# EAGLE design solar_hv4-JR-01 (EAGLE 5.11)
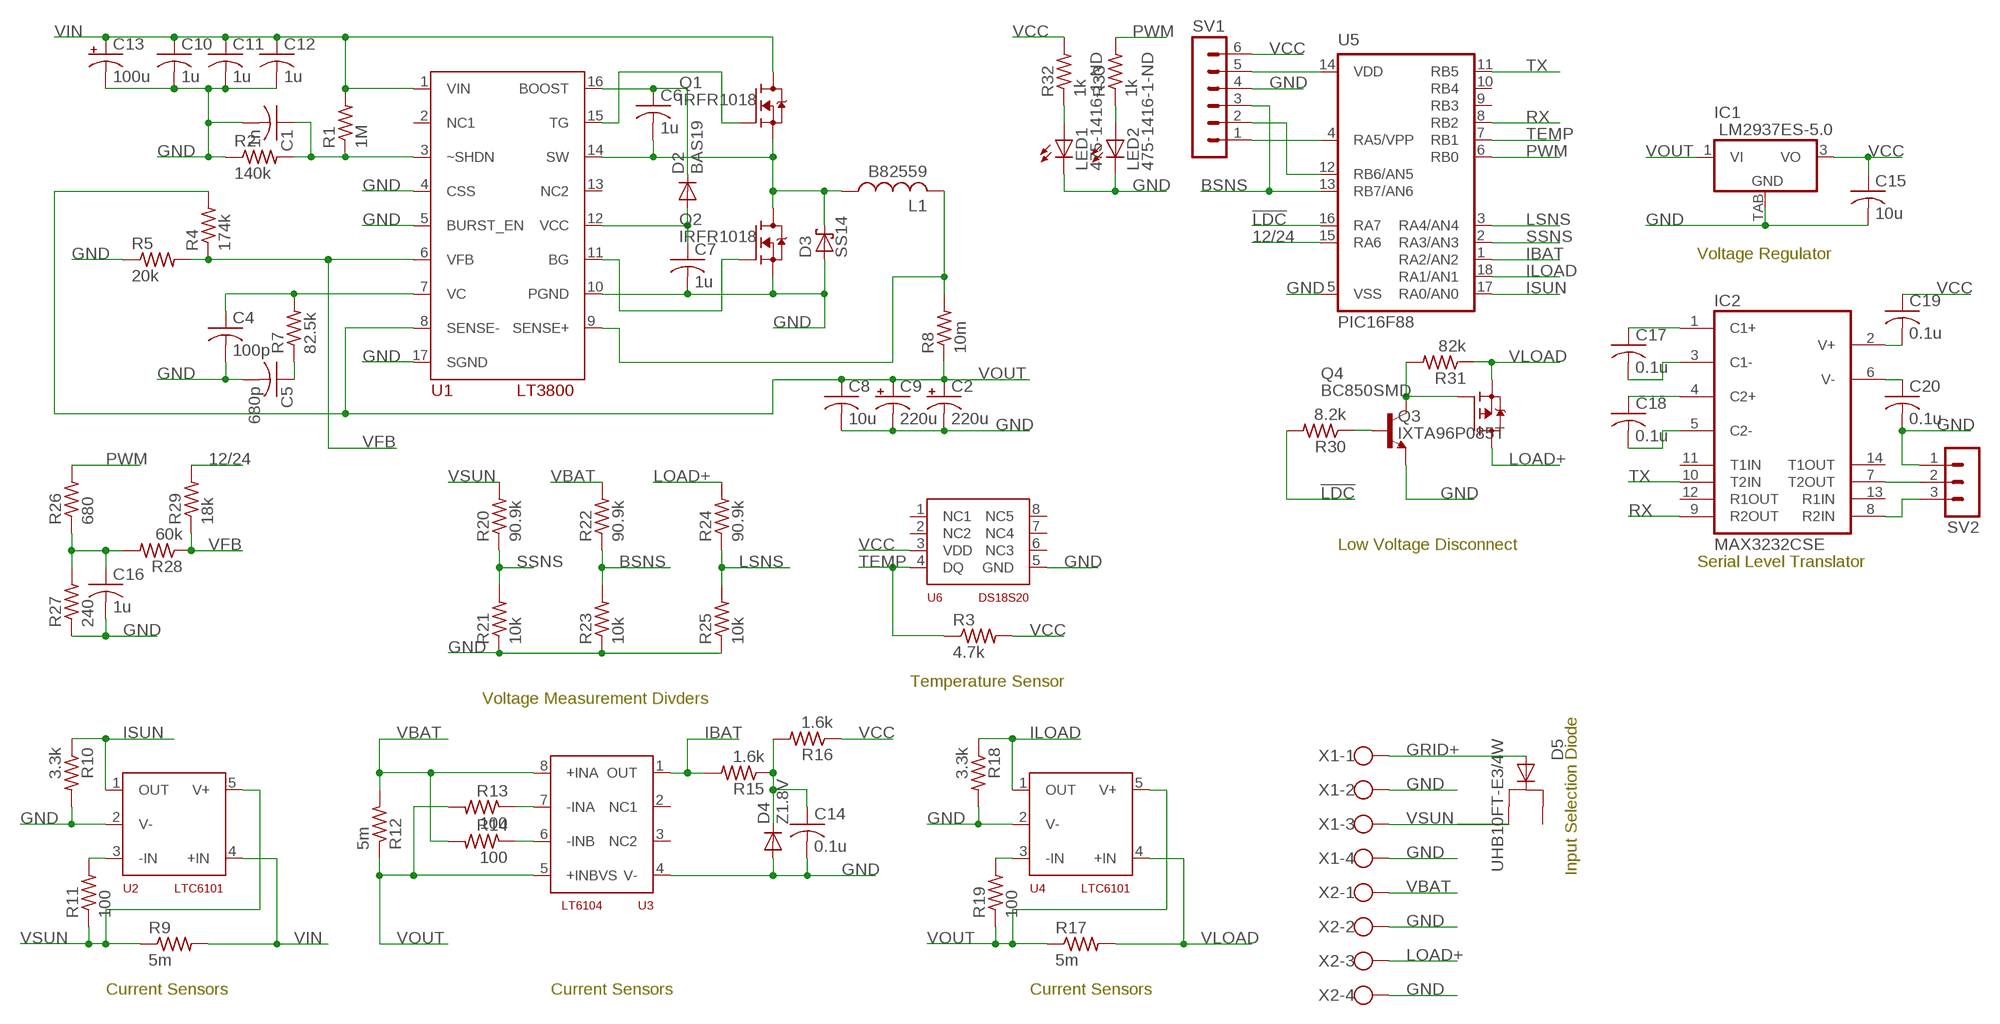
[diagram p0: schematic, sheet 1]

## Parts
C1  1n  C-USC1206  [C1206]
C2  220u  CPOL-USUD-10X10  [UD-10X10_NICHICON]
C4  100p  C-USC1206  [C1206]
C5  680p  C-USC1206  [C1206]
C6  1u  C-USC1206  [C1206]
C7  1u  C-USC1206  [C1206]
C8  10u  C-USC1210  [C1210]
C9  220u  CPOL-USUD-10X10  [UD-10X10_NICHICON]
C10  1u  C-USC1206  [C1206]
C11  1u  C-USC1206  [C1206]
C12  1u  C-USC1206  [C1206]
C13  100u  CPOL-USG  [PANASONIC_G]
C14  0.1u  C-USC1206  [C1206]
C15  10u  C-USC1210  [C1210]
C16  1u  C-USC1206  [C1206]
C17  0.1u  C-USC1206  [C1206]
C18  0.1u  C-USC1206  [C1206]
C19  0.1u  C-USC1206  [C1206]
C20  0.1u  C-USC1206  [C1206]
D2  BAS19  [SOT23]
D3  SS14  [SMA]
D4  Z1.8V  DIODE-SOD123  [SOD123]
D5  UHB10FT-E3/4W  BY229B  [TO263AB]
IC1  LM2937ES-5.0  LM340S-05  [TO263-3]
IC2  MAX3232CSE  [SO16]
L1  B82559  [L23X25MM]
LED1  475-1416-1-ND  LEDCHIPLED_1206  [CHIPLED_1206]
LED2  475-1416-1-ND  LEDCHIPLED_1206  [CHIPLED_1206]
Q1  IRFR1018  [TO252]
Q2  IRFR1018  [TO252]
Q3  IXTA96P085T  SPB80P06P  [TO263]
Q4  BC850SMD  [SOT23-BEC]
R1  1M  R-US_R1206  [R1206]
R2  140k  R-US_R1206  [R1206]
R3  4.7k  R-US_R1206  [R1206]
R4  174k  R-US_R1206  [R1206]
R5  20k  R-US_R1206  [R1206]
R7  82.5k  R-US_R1206  [R1206]
R8  10m  FCSLXXRXXXFCSL90R010  [FCSL90-10M]
R9  5m  FCSLXXRXXXFCSL64R005  [FCSL64-5M]
R10  3.3k  R-US_R1206  [R1206]
R11  100  R-US_R1206  [R1206]
R12  5m  FCSLXXRXXXFCSL64R005  [FCSL64-5M]
R13  100  R-US_R1206  [R1206]
R14  100  R-US_R1206  [R1206]
R15  1.6k  R-US_R1206  [R1206]
R16  1.6k  R-US_R1206  [R1206]
R17  5m  FCSLXXRXXXFCSL64R005  [FCSL64-5M]
R18  3.3k  R-US_R1206  [R1206]
R19  100  R-US_R1206  [R1206]
R20  90.9k  R-US_R1206  [R1206]
R21  10k  R-US_R1206  [R1206]
R22  90.9k  R-US_R1206  [R1206]
R23  10k  R-US_R1206  [R1206]
R24  90.9k  R-US_R1206  [R1206]
R25  10k  R-US_R1206  [R1206]
R26  680  R-US_R1206  [R1206]
R27  240  R-US_R1206  [R1206]
R28  60k  R-US_R1206  [R1206]
R29  18k  R-US_R1206  [R1206]
R30  8.2k  R-US_R1206  [R1206]
R31  82k  R-US_R1206  [R1206]
R32  1k  R-US_R1206  [R1206]
R33  1k  R-US_R1206  [R1206]
SV1  MA06-1  [MA06-1]
SV2  MA03-1  [MA03-1]
U1  LT3800  [TSSOP16]
U2  LTC6101  LT6101  [TSOT-23-5]
U3  LT6104  LTC1604  [MSOP8]
U4  LTC6101  LT6101  [TSOT-23-5]
U5  PIC16F88  PIC16F87/88  [DIL18]
U6  DS18S20  DS18S20Z  [SOIC8]
X1  W237-4  [W237-4]
X2  W237-4  [W237-4]

## Nets
12/24: R29.2 U5.15(RA6)
!LDC: R30.2 U5.16(RA7)
BG: Q2.1(G) U1.11(BG)
BSNS: R22.1 R23.2 SV1.3 U5.13(RB7/AN6)
GND: C1.2 C2.- C4.2 C5.2 C7.2 C8.2 C9.- C10.2 C11.2 C12.2 C13.- C14.2 C15.2 C16.2 C20.2 D3.A D4.A IC1.TAB(GND) LED1.C LED2.C Q2.2(S) Q4.E R2.1 R5.1 R10.2 R18.2 R21.1 R23.1 R25.1 R27.1 SV1.4 SV2.1 U1.4(CSS) U1.5(BURST_EN) U1.10(PGND) U1.17(SGND) U2.2(V-) U3.4(V-) U4.2(V-) U5.5(VSS) U6.5(GND) X1.2 X1.4 X2.2 X2.4
GRID+: D5.2 X1.1
IBAT: R15.2 U3.1(OUT) U5.1(RA2/AN2)
ILOAD: R18.1 U4.1(OUT) U5.18(RA1/AN1)
ISUN: R10.1 U2.1(OUT) U5.17(RA0/AN0)
LOAD+: Q3.3(D) R24.2 X2.3
LSNS: R24.1 R25.2 U5.3(RA4/AN4)
N$1: L1.P$2 R8.P$2 U1.9(SENSE+)
N$2: C1.1 R1.1 R2.2 U1.3(~SHDN)
N$5: R11.2 U2.3(-IN)
N$6: C16.1 R26.1 R27.2 R28.2
N$7: C6.1 D2.3(C) U1.16(BOOST)
N$9: C4.1 R7.2 U1.7(VC)
N$10: C5.1 R7.1
N$11: C6.2 D3.K(C) L1.P$1 Q1.2(S) Q2.3(D) U1.14(SW)
N$13: C7.1 D2.1(A) U1.12(VCC)
N$14: R14.1 U3.6(-INB)
N$15: R19.2 U4.3(-IN)
N$17: R13.1 U3.7(-INA)
N$18: C14.1 D4.C R15.1 R16.2
N$19: SV1.1 U5.4(RA5/VPP)
N$21: SV1.5 U5.14(VDD)
N$22: C17.1 IC2.1(C1+)
N$23: C17.2 IC2.3(C1-)
N$24: SV1.2 U5.12(RB6/AN5)
N$25: C18.1 IC2.4(C2+)
N$26: C18.2 IC2.5(C2-)
N$27: C19.2 IC2.2(V+)
N$28: C20.1 IC2.6(V-)
N$29: IC2.7(T2OUT) SV2.2
N$30: IC2.8(R2IN) SV2.3
N$31: LED1.A R32.1
N$32: Q3.1(G) Q4.C R31.2
N$33: Q4.B R30.1
N$34: LED2.A R33.1
PWM: R26.2 R33.2 U5.6(RB0)
RX: IC2.9(R2OUT) U5.8(RB2)
SSNS: R20.1 R21.2 U5.2(RA3/AN3)
TEMP: R3.1 U5.7(RB1) U6.4(DQ)
TG: Q1.1(G) U1.15(TG)
TX: IC2.10(T2IN) U5.11(RB5)
VBAT: R12.P$2 R14.2 R22.2 U3.8(+INA) X2.1
VCC: C15.1 C19.1 IC1.3(VO) R3.2 R16.1 R32.2 SV1.6 U6.3(VDD)
VFB: R4.1 R5.2 R28.1 R29.1 U1.6(VFB)
VIN: C10.1 C11.1 C12.1 C13.+ Q1.3(D) R1.2 R9.P$2 U1.1(VIN) U2.4(+IN)
VLOAD: Q3.2(S) R17.P$2 R31.1 U4.4(+IN)
VOUT: C2.+ C8.1 C9.+ IC1.1(VI) R4.2 R8.P$1 R12.P$1 R13.2 R17.P$1 R19.1 U1.8(SENSE-) U3.5(+INBVS) U4.5(V+)
VSUN: D5.K R9.P$1 R11.1 R20.2 U2.5(V+) X1.3
Unconnected: D5.1 IC2.11(T1IN) IC2.12(R1OUT) IC2.13(R1IN) IC2.14(T1OUT) U1.2(NC1) U1.13(NC2) U3.2(NC1) U3.3(NC2) U5.9(RB3) U5.10(RB4) U6.1(NC1) U6.2(NC2) U6.6(NC3) U6.7(NC4) U6.8(NC5)

## Notes on the sheet
- Voltage Regulator
- Low Voltage Disconnect
- Serial Level Translator
- Temperature Sensor
- Voltage Measurement Divders
- Input Selection Diode
- Current Sensors | Current Sensors | Current Sensors

## Power pins joined to a net without a drawn wire
GND: IC2.15(GND)
VCC: IC2.16(VCC)

## Library data of the parts
C1 C4-C8 C10-C12 C14-C20 = rcl:C-US: CAPACITOR, American symbol
C2 C9 C13 = rcl:CPOL-US: POLARIZED CAPACITOR, American symbol
D2 = mylib:BAS19: Small Signal Diode
D3 = mylib:SS14: Schottky Power Rectifier SMA
D4 = diode:DIODE-: DIODE
D5 = diode:BY229B: DIODE Fast Switching Rectifier, 8A (Vishay)
IC1 = linear:LM340?-*: Positive VOLTAGE REGULATOR Source: http://cache.national.com/ds/LM/LM340.pdf
IC2 = maxim:MAX3232*: True RS-232 Transceivers 3.0V to 5.5V, Low-Power up to 1Mbps, Using Four 0.1µF External Capacitors Source: http://pdfserv.maxim-ic.com/en/ds/MAX3222-MAX3241.pdf
L1 = mylib:B82559: Helical Power Inductor 23mm x 25mm
LED1 LED2 = led:LED: LED OSRAM: - CHIPLED LG R971, LG N971, LY N971, LG Q971, LY Q971, LO R971, LY R971 LH N974, LH R974 LS Q976, LO Q976, LY Q976 LO Q996 - Hyper CHIPLED LW Q18S LB Q993, LB Q99A, LB R99A - SideLED LS A670, LO A670, LY A670, LG A670, LP A670 LB A673, LV A673, LT A673, LW A673 LH A674 LY A675 LS A676, LA A676, LO A676, LY A676, LW A676 LS A679, LY A679, LG A679 - Hyper Micro SIDELED® LS Y876, LA Y876, LO Y876, LY Y876 LT Y87S - SmartLED LW L88C, LW L88S LB L89C, LB L89S, LG L890 LS L89K, LO L89K, LY L89K LS L896, LA L896, LO L896, LY L896 - TOPLED LS T670, LO T670, LY T670, LG T670, LP T670 LSG T670, LSP T670, LSY T670, LOP T670, LYG T670 LG T671, LOG T671, LSG T671 LB T673, LV T673, LT T673, LW T673 LH T674 LS T676, LA T676, LO T676, LY T676, LB T676, LH T676, LSB T676, LW T676 LB T67C, LV T67C, LT T67C, LS T67K, LO T67K, LY T67K, LW E67C LS E67B, LA E67B, LO E67B, LY E67B, LB E67C, LV E67C, LT E67C LW T67C LS T679, LY T679, LG T679 LS T770, LO T770, LY T770, LG T770, LP T770 LB T773, LV T773, LT T773, LW T773 LH T774 LS E675, LA E675, LY E675, LS T675 LS T776, LA T776, LO T776, LY T776, LB T776 LHGB T686 LT T68C, LB T68C - Hyper Mini TOPLED® LB M676 - Mini TOPLED Santana® LG M470 LS M47K, LO M47K, LY M47K Source: http://www.osram.convergy.de LUXEON: - LUMILED® LXK2-PW12-R00, LXK2-PW12-S00, LXK2-PW14-U00, LXK2-PW14-V00 LXK2-PM12-R00, LXK2-PM12-S00, LXK2-PM14-U00 LXK2-PE12-Q00, LXK2-PE12-R00, LXK2-PE12-S00, LXK2-PE14-T00, LXK2-PE14-U00 LXK2-PB12-K00, LXK2-PB12-L00, LXK2-PB12-M00, LXK2-PB14-N00, LXK2-PB14-P00, LXK2-PB14-Q00 LXK2-PR12-L00, LXK2-PR12-M00, LXK2-PR14-Q00, LXK2-PR14-R00 LXK2-PD12-Q00, LXK2-PD12-R00, LXK2-PD12-S00 LXK2-PH12-R00, LXK2-PH12-S00 LXK2-PL12-P00, LXK2-PL12-Q00, LXK2-PL12-R00 Source: www.luxeon.com KINGBRIGHT: KA-3528ASYC Source: www.kingbright.com
Q1 Q2 = mylib:IRFR1018
Q3 = transistor-fet:SPB80P06P: SIPMOS (R) Power-Transistor P-Channel, Enhancement mode Source: http://www.infineon.com/upload/Document/cmc_upload/documents/011/3685/SPP80P06P.pdf
Q4 = transistor-npn:BC850*: NPN Transistor
R1-R5 R7 R10 R11 R13-R16 R18-R33 = rcl:R-US_: RESISTOR, American symbol
R8 R9 R12 R17 = mylib:FCSLXXRXXX: Metal Foil Current Sense 10m
SV1 = con-lstb:MA06-1: PIN HEADER
SV2 = con-lstb:MA03-1: PIN HEADER
U1 = mylib:LT3800: High-Voltage Synchronous Current Mode Step-Down Controller
U2 U4 = mylib:LT6101: High Voltage High-Side Current Sense Amplifier in SOT-23
U3 = mylib:LTC1604: High Voltage, High Side, Bi-Directional Current Sense Amplifier
U5 = mylib:PIC16F87/88: PIC16F87/88
U6 = mylib:DS18S20Z: High-Precision 1-Wire Digital Thermometer
X1 X2 = con-wago-500:W237-4: WAGO SCREW CLAMP

## Board
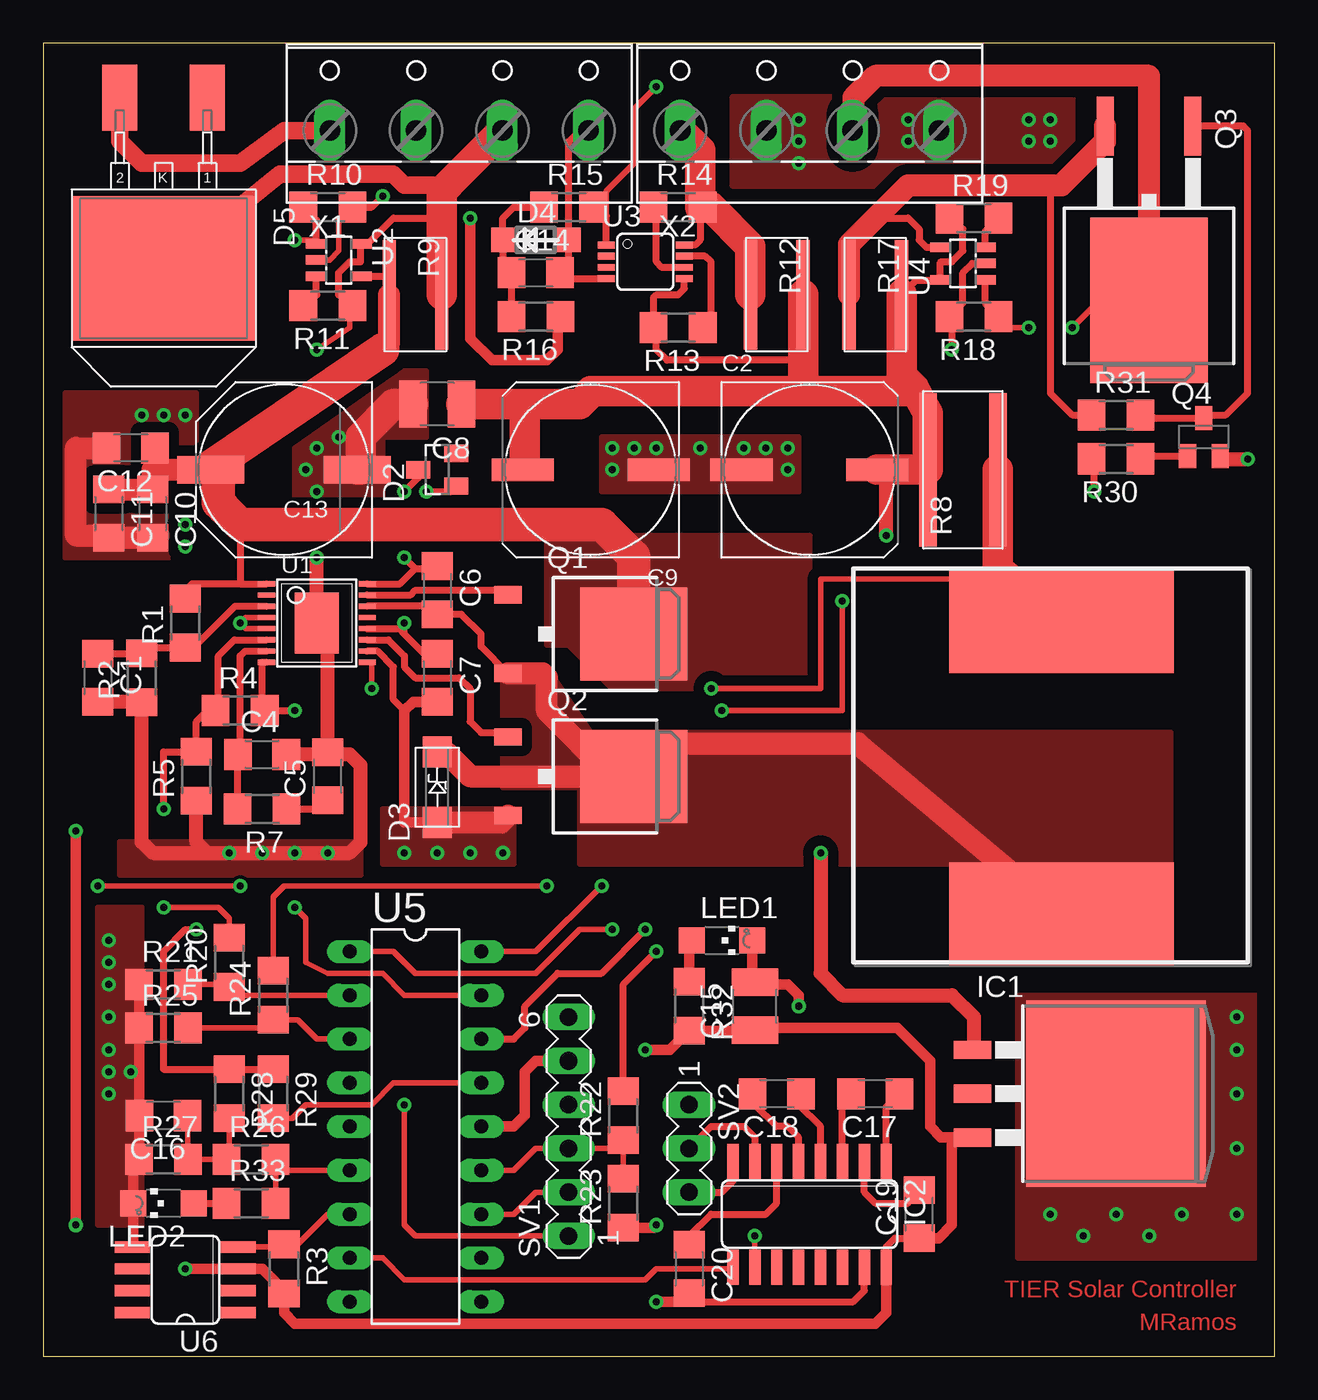
[diagram p1: board, top side]
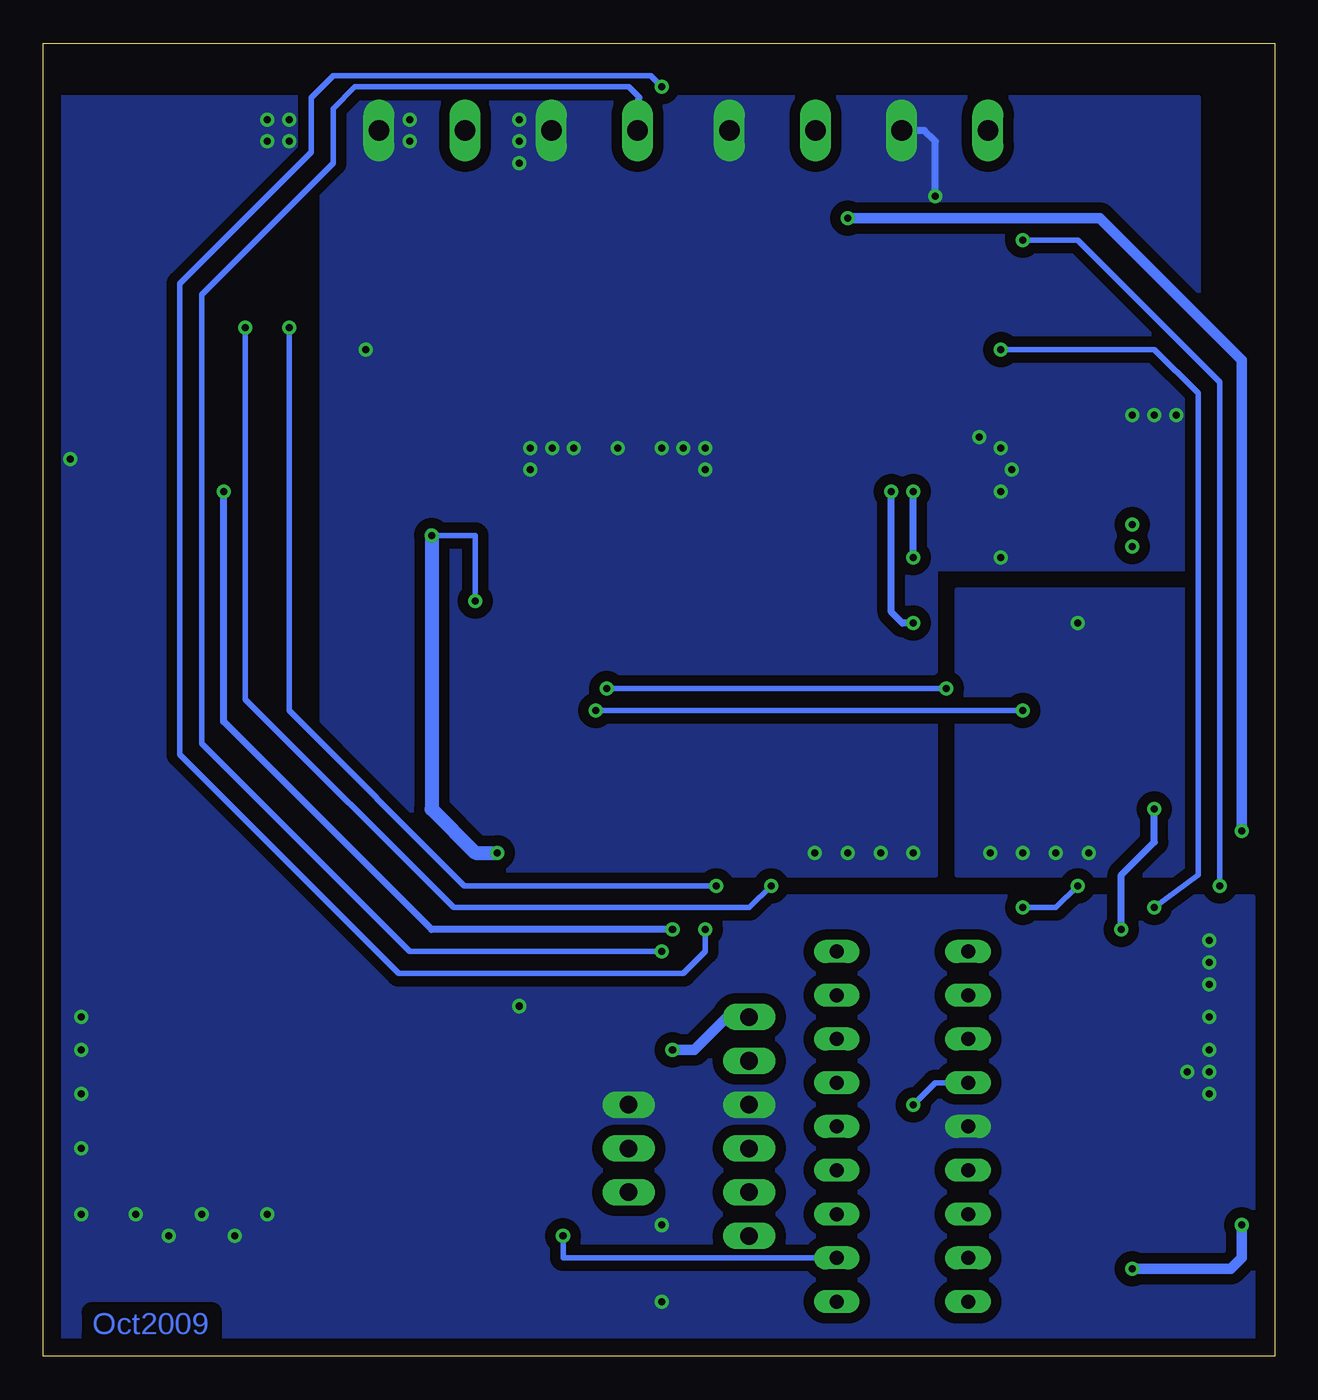
[diagram p2: board, bottom side, seen from below]

Size 71.42 x 76.19 mm. Coordinates in mm from the lower left corner, seen from the top.
Outline: 0,0 71.42,0 71.42,76.19 0,76.19 0,0
Copper layers (1*16): Top 0.035mm / dielectric 1.5mm / Bottom 0.035mm
Design rules "default": minimum track width 10mil, minimum drill 24mil, track to track 8mil, track to pad 8mil, pad to pad 8mil, via to via 8mil, smd to smd 8mil, copper to edge 40mil, drill to drill 8mil, minimum pad ring 10mil, minimum via ring 8mil, stop-mask expansion 4mil, vias tented up to drill 0mil, thermal gap 10mil

### Footprints (pad centres in the part's own frame; a part is rotated, then mirrored left to right if it is on the bottom)
C1206 = smd 1.6 x 1.8: 1 -1.4,0; 2 1.4,0
UD-10X10_NICHICON = smd 3.6 x 1.3: + 3.925,0; - -3.95,0
C1210 = smd 1.6 x 2.7: 1 -1.4,0; 2 1.4,0
PANASONIC_G = smd 3.9 x 1.6: + 4.25,0; - -4.25,0
SOT23 = smd 1 x 1.4: 1 -0.95,-1.1; 2 0.95,-1.1; 3 0,1.1
SMA = smd 1.8 x 1.7: A -2.05,0; K 2.05,0
SOD123 = smd 1.4 x 1.4: A 1.9,0; C -1.9,0
TO263AB = smd 2.032 x 3.81: 1 -2.54,0; 2 2.54,0 | smd 10.668 x 8.382: K 0,9.906
TO263-3 = smd 1.067 x 2.159: 1 -2.54,-5.791; 2 0,-5.791; 3 2.54,-5.791 | smd 10.8 x 10.41: TAB 0,2.54
SO16 = smd 0.66 x 2.032: 1 -4.445,-3.073; 2 -3.175,-3.073; 3 -1.905,-3.073; 4 -0.635,-3.073; 5 0.635,-3.073; 6 1.905,-3.073; 7 3.175,-3.073; 8 4.445,-3.073; 9 4.445,3.073; 10 3.175,3.073; 11 1.905,3.073; 12 0.635,3.073; 13 -0.635,3.073; 14 -1.905,3.073; 15 -3.175,3.073; 16 -4.445,3.073
L23X25MM = smd 6 x 13: P$1 -8,0; P$2 9,0
CHIPLED_1206 = smd 1.5 x 1.5: A 0,-1.75; C 0,1.75
TO252 = smd 1 x 1.6: 1 -2.28,-6.07; 2 2.28,-6.07 | smd 5.4 x 6.2: 3 0,1.23
TO263 = smd 1 x 3.4: 1 -2.54,-6.6; 2 2.54,-6.6 | smd 6.8 x 9.6: 3 0,3.5
SOT23-BEC = smd 1 x 1.4: B -0.95,-1.1; C 0,1.1; E 0.95,-1.1
R1206 = smd 1.6 x 1.803: 1 -1.422,0; 2 1.422,0
FCSL90-10M = smd 1.016 x 8.89: P$1 -2.032,0; P$2 2.032,0
FCSL64-5M = smd 0.762 x 6.35: P$1 -1.524,0; P$2 1.524,0
MA06-1 = drill 1.016 long: 1 -6.35,0; 2 -3.81,0; 3 -1.27,0; 4 1.27,0; 5 3.81,0; 6 6.35,0
MA03-1 = drill 1.016 long: 1 -2.54,0; 2 0,0; 3 2.54,0
TSSOP16 = smd 0.305 x 0.991: 1 -2.275,-2.918; 2 -1.625,-2.918; 3 -0.975,-2.918; 4 -0.325,-2.918; 5 0.325,-2.918; 6 0.975,-2.918; 7 1.625,-2.918; 8 2.275,-2.918; 9 2.275,2.918; 10 1.625,2.918; 11 0.975,2.918; 12 0.325,2.918; 13 -0.325,2.918; 14 -0.975,2.918; 15 -1.625,2.918; 16 -2.275,2.918 | smd 3.556 x 2.54: 17 0,0
TSOT-23-5 = smd 0.55 x 1.2: 1 -1.05,-1.3; 2 -0.1,-1.3; 3 0.85,-1.3; 4 0.85,1.3; 5 -1.05,1.3
MSOP8 = smd 0.4 x 1: 1 -0.976,-2.263; 2 -0.326,-2.263; 3 0.324,-2.263; 4 0.974,-2.263; 5 0.974,2.262; 6 0.324,2.262; 7 -0.326,2.262; 8 -0.976,2.262
DIL18 = drill 0.813 long: 1 -10.16,-3.81; 2 -7.62,-3.81; 3 -5.08,-3.81; 4 -2.54,-3.81; 5 0,-3.81; 6 2.54,-3.81; 7 5.08,-3.81; 8 7.62,-3.81; 9 10.16,-3.81; 10 10.16,3.81; 11 7.62,3.81; 12 5.08,3.81; 13 2.54,3.81; 14 0,3.81; 15 -2.54,3.81; 16 -5.08,3.81; 17 -7.62,3.81; 18 -10.16,3.81
SOIC8 = smd 0.66 x 2.032: 1 -1.905,-3.073; 2 -0.635,-3.073; 3 0.635,-3.073; 4 1.905,-3.073; 5 1.905,3.073; 6 0.635,3.073; 7 -0.635,3.073; 8 -1.905,3.073
W237-4 = drill 1.194 long: 1 -7.5,-1.27; 2 -2.5,-1.27; 3 2.5,-1.27; 4 7.5,-1.27

### Placement (x,y rotation side)
C1  3.17,39.37 270 top
C2  44.45,51.44 0 top
C4  12.7,34.92 0 top
C5  16.51,33.66 90 top
C6  22.86,44.45 270 top
C7  22.86,39.37 270 top
C8  22.86,55.24 180 top
C9  31.75,51.44 180 top
C10  6.35,48.9 270 top
C11  3.81,48.9 270 top
C12  5.08,52.7 180 top
C13  13.97,51.44 180 top
C14  28.57,62.87 0 top
C15  41.27,20.32 90 top
C16  6.99,13.97 180 top
C17  48.26,15.24 180 top
C18  42.55,15.24 180 top
C19  50.8,8.26 90 top
C20  37.47,5.08 270 top
D2  22.86,51.44 90 top
D3  22.86,33.02 90 top
D4  28.57,64.77 0 top
D5  6.99,73.03 180 top
IC1  59.69,15.24 270 top
IC2  44.45,8.26 180 top
L1  59.05,33.66 90 top
LED1  39.37,24.13 270 top
LED2  6.99,8.89 90 top
Q1  33.02,41.91 270 top
Q2  33.02,33.66 270 top
Q3  64.14,64.77 180 top
Q4  67.31,53.34 0 top
R1  8.26,42.55 90 top
R2  5.71,39.37 90 top
R3  13.97,5.08 270 top
R4  11.43,37.47 0 top
R5  8.89,33.66 90 top
R7  12.7,31.75 180 top
R8  53.34,51.44 0 top
R9  21.59,61.59 180 top
R10  16.51,66.67 0 top
R11  16.51,60.96 180 top
R12  42.55,61.59 180 top
R13  36.83,59.69 180 top
R14  36.83,66.67 0 top
R15  30.48,66.67 0 top
R16  28.57,60.33 180 top
R17  48.26,61.59 180 top
R18  53.98,60.33 180 top
R19  53.98,66.04 0 top
R20  10.79,22.86 90 top
R21  6.99,21.59 0 top
R22  33.66,13.97 90 top
R23  33.66,8.89 90 top
R24  13.34,20.95 90 top
R25  6.99,19.05 0 top
R26  12.06,11.43 0 top
R27  6.99,11.43 0 top
R28  10.79,15.24 270 top
R29  13.34,15.24 270 top
R30  62.23,52.07 180 top
R31  62.23,54.61 0 top
R32  37.47,20.32 270 top
R33  12.06,8.89 0 top
SV1  30.48,13.34 90 top
SV2  37.47,12.06 270 top
U1  15.88,42.55 270 top
U2  17.14,63.5 270 top
U3  34.92,63.5 270 top
U4  53.34,63.5 90 top
U5  21.59,13.34 270 top
U6  8.26,4.45 90 top
X1  24.13,72.39 0 top
X2  44.45,72.39 0 top

### Tracks (layer width: path | path; a pad name or v marks a point on that pad's centre or on a via)
12/24
  Top 0.305: U5.15 20.32,15.88 19.05,14.61 15.24,14.61 14.45,13.82 R29.2
!LDC  (via drill 0.41)
  Top 0.406: U5.16 27.3,18.41 27.94,19.05 27.94,20.32 29.84,22.23 32.38,22.23 v34.92,24.77 | v60.96,50.16 60.96,52.55 R30.2
  Bottom 0.406: v34.92,24.77 48.9,24.77 60.96,36.83 v60.96,50.16
BG
  Top 0.406: U1.11 20.02,41.57 20.95,40.64 20.95,40.01 21.59,39.37 24.13,39.37 24.77,38.73 24.77,36.83 25.4,36.2 26.69,36.2 Q2.1
BSNS
  Top 0.305: U5.13 27.3,10.79 28.57,12.06 SV1.3 33.66,12.06 R22.1 R23.2
GND  (via drill 0.41)
  Top 0.305: U2.2 16.61,63.6 17.14,64.14 17.14,65.89 | U1.5 11.76,42.22 v11.43,42.55 11.76,42.87 U1.4
  Top 0.406: 17.14,65.89 R10.2 19.05,66.67 v19.68,67.31 | U3.4 30.31,62.53 C14.2 30.48,63.37 D4.A 30.48,70.48 31.11,71.12 X1.4 | C20.2 37.59,3.68 38.1,3.17 46.99,3.17 47.62,3.81 IC2.15 | U1.10 19.41,40.92 20.32,40.01 20.32,38.1 20.95,37.47 | 16.51,41.27 16.51,41.91 U1.17 15.55,42.22 | U4.2 53.88,63.4 53.34,62.87 53.34,61.11 R18.2 52.7,60.33 v52.7,58.42
  Top 0.61: D3.A 20.95,30.97 20.95,37.47 21.46,37.97 C7.2 | U6.5 5.24,6.35 | LED2.C 5.08,8.73 | LED2.C 5.24,11.1 R27.1 5.56,13.95 C16.2 5.58,19.05 | 5.58,19.05 5.58,21.57 R21.1 | 5.58,19.05 R25.1 | R23.1 35.41,7.47 v35.56,7.62 | C20.2 37.47,3.17 v35.56,3.17 | LED1.C 41.12,22.23 41.27,22.23 C15.2 41.27,21.59 43.18,21.59 43.81,20.95 v43.81,20.32 | 5.24,6.35 5.71,6.35 | 5.24,6.35 LED2.C
  Top 0.813: Q4.E 68.26,52.07 v69.85,52.07 | R5.1 8.89,29.84 9.53,29.21 | 9.53,29.21 v10.79,29.21 v12.7,29.21 v14.61,29.21 v16.51,29.21 17.78,29.21 18.41,29.84 18.41,34.29 17.78,34.92 16.64,34.92 C5.2 | C4.2 16.38,34.92 C5.2 | C5.2 16.51,41.27 | C1.2 5.69,37.97 R2.1 5.71,29.84 6.35,29.21 9.53,29.21 | U1.17 v15.88,46.35
  Top 1.27: D3.A 26.55,30.97 Q2.2 | C11.2 C10.2 | 3.17,47.62 1.91,47.62 1.91,52.7 C12.2
  Top 1.778: C13.- 18.41,51.44 18.41,53.34 20.32,55.24 C8.2
  Bottom 0.406: v19.68,67.31 19.68,70.48 20.32,71.12 X1.2
  other vias: 69.22,12.06 60.33,6.99 64.14,6.99 69.22,8.26 69.22,17.78 69.22,15.24 66.04,8.26 58.42,8.26 62.23,8.26 3.81,19.68 3.81,22.86 3.81,24.13 3.81,21.59 3.81,16.51 5.08,16.51 3.81,15.24 3.81,17.78 26.67,29.21 24.77,29.21 22.86,29.21 20.95,29.21 5.71,54.61 6.99,54.61 8.26,54.61 15.88,52.7 41.91,52.7 35.56,52.7 33.02,52.7 15.88,50.16 15.24,51.44 17.14,53.34 43.18,52.7 38.1,52.7 34.29,52.7 33.02,51.44 69.22,19.68 50.16,71.75 50.16,70.48 57.15,71.75 58.42,71.75 58.42,70.48 57.15,70.48 43.81,69.22 43.81,70.48 43.81,71.75 43.18,51.44 40.64,52.7
  pour Top (isolate 0.61, no thermals): 3.17,26.04 3.17,7.62 5.71,7.62 5.71,26.04
  pour Top (isolate 0.61, no thermals): 19.68,31.75 27.3,31.75 27.3,28.57 19.68,28.57
  pour Top (isolate 0.61, no thermals): 20.95,57.15 14.61,52.7 14.61,49.53 19.68,49.53 19.68,53.34 22.23,53.34 22.23,57.15
  pour Top (isolate 0.61, no thermals): 1.27,55.88 1.27,46.35 8.89,46.35 8.89,55.88
  pour Top (isolate 0.61, no thermals): 56.52,20.95 56.52,5.71 70.48,5.71 70.48,20.95
  pour Top (isolate 0.61, no thermals): 32.38,53.34 32.38,50.16 43.81,50.16 43.81,53.34
  pour Bottom (isolate 0.61, no thermals): 4.45,73.03 4.45,45.72 19.68,45.72 19.68,27.94 55.24,27.94 55.24,73.03
  pour Bottom (isolate 0.61, no thermals): 1.27,26.67 1.27,0.64 70.48,0.64 70.48,73.03 56.52,73.03 56.52,26.67
  pour Bottom (isolate 0.61, no thermals): 4.45,44.45 4.45,27.94 18.41,27.94 18.41,44.45
  pour Top (no thermals): 4.45,29.84 4.45,27.94 18.41,27.94 18.41,29.84
  pour Top (isolate 0.61, no thermals): 40.01,73.03 40.01,67.94 58.42,67.94 59.69,70.48 59.69,73.03
GRID+
  Top 1.016: X1.1 13.97,71.12 11.43,69.22 5.71,69.22 4.45,70.48 D5.2
IBAT  (via drill 0.41)
  Top 0.305: U3.1 32.66,67.59 34.29,69.22 34.29,72.39 v35.56,73.66 | U5.1 20.32,23.5 21.59,22.23 28.57,22.23 31.11,24.77 v33.02,24.77
  Top 0.406: R15.2 32.66,66.17 U3.1
  Bottom 0.305: v35.56,73.66 36.2,74.3 54.61,74.3 55.88,73.03 55.88,69.85 63.5,62.23 63.5,34.92 50.8,22.23 34.29,22.23 33.02,23.5 v33.02,24.77
ILOAD  (via drill 0.41)
  Top 0.305: U5.18 28.57,23.5 v32.38,27.3 | v57.15,59.69 55.88,59.69 55.4,60.17 R18.1
  Top 0.406: U4.1 54.64,61.08 R18.1
  Bottom 0.305: v32.38,27.3 46.99,27.3 57.15,37.47 v57.15,59.69
ISUN  (via drill 0.41)
  Top 0.305: v14.61,64.77 15.62,64.77 U2.1 | U5.17 20.95,20.95 19.68,22.23 16.51,22.23 15.24,22.86 15.24,25.4 v14.61,26.04 | v3.17,27.3 v11.43,27.3
  Top 0.406: U2.1 15.85,65.92 R10.1
  Bottom 0.305: v3.17,27.3 3.17,56.52 11.43,64.77 v14.61,64.77 | v14.61,26.04 12.7,26.04 v11.43,27.3
LOAD+  (via drill 0.41)
  Top 0.305: R24.2 13.34,26.67 13.97,27.3 v29.21,27.3 | v59.69,59.69 62.23,62.23 63.5,62.23 63.81,62.54 Q3.3
  Top 1.27: X2.3 46.99,71.16 46.99,73.03 48.26,74.3 64.14,74.3 Q3.3
  Bottom 0.305: v29.21,27.3 30.48,26.04 47.62,26.04 59.69,38.1 v59.69,59.69
LSNS
  Top 0.305: U5.3 15.88,18.41 14.76,19.53 R24.1 12.85,19.05 R25.2
N$1  (via drill 0.41)
  Top 0.305: U1.9 19.05,40.27 v19.05,38.73 | v38.73,38.73 45.09,38.73 45.09,43.81 45.09,45.09 56.41,45.09 58.45,43.21 L1.P$2
  Top 1.778: R8.P$2 55.37,45.65 58.45,43.21
  Bottom 0.305: v19.05,38.73 v38.73,38.73
N$2
  Top 0.406: C1.1 5.69,40.77 R2.2 6.05,41.12 R1.1 8.41,41.27 8.89,41.27 11.13,43.52 U1.3
N$3  (via drill 0.41)
  other vias: 8.26,46.99
N$4  (via drill 0.41)
  other vias: 8.26,48.26
N$5
  Top 0.406: U2.3 15.85,61.62 15.88,61.59 15.72,61.59 R11.2
N$6
  Top 0.305: R28.2 10.79,11.58 R26.1 R27.2 8.38,11.45 C16.1
N$7  (via drill 0.41)
  Top 0.406: U1.16 20.69,44.82 21.59,45.72 | 21.59,45.72 22.73,45.72 C6.1 | D2.3 21.76,50.97 v20.95,50.16 | 21.59,45.72 v20.95,46.35
  Bottom 0.406: v20.95,46.35 v20.95,50.16
N$9
  Top 0.406: R7.2 11.28,34.9 C4.1 11.43,35.05 11.43,40.64 11.71,40.92 U1.7
N$10
  Top 0.406: R7.1 16,31.75 C5.1
N$11
  Top 0.406: U1.14 22.39,43.52 C6.2 24.26,43.05 25.4,41.91 25.4,41.18 Q1.2
  Top 1.27: Q1.2 28.95,39.63 29.21,39.37 29.21,37.47 33.02,33.66 | 33.02,33.66 Q2.3 34.92,33.66 36.83,35.56 47.24,35.56 L1.P$1 | D3.K 23.35,35.07 24.77,33.66 33.02,33.66
  pour Top (isolate 0.61, no thermals): 26.67,40.01 26.67,33.02 31.11,33.02 31.11,28.57 65.41,28.57 65.41,36.2 31.75,36.2 29.21,40.01
N$13  (via drill 0.41)
  Top 0.406: U1.12 20.64,42.22 20.95,41.91 | 20.95,41.91 22.23,40.64 22.73,40.64 C7.1 | D2.1 23.64,50.16 v22.23,50.16 | 20.95,41.91 v20.95,42.55
  Bottom 0.406: v22.23,50.16 22.23,43.18 21.59,42.55 v20.95,42.55
N$14
  Top 0.406: U3.6 35.88,63.18 35.56,63.5 35.56,66.52 R14.1
N$15
  Top 0.406: U4.3 54.64,65.28 R19.2
N$17
  Top 0.406: U3.7 38.41,63.83 38.73,63.5 38.73,60.17 R13.1
N$18
  Top 0.406: R15.1 27.3,66.67 26.67,66.04 D4.C 26.68,63.37 C14.1 27.18,60.35 R16.2
N$19  (via drill 0.41)
  Top 0.305: SV1.1 21.59,6.99 20.95,7.62 v20.95,14.61
  Bottom 0.305: v20.95,14.61 19.68,15.88 U5.4
N$21
  Top 0.61: U5.14 27.3,13.34 27.94,13.97 27.94,16.51 28.57,17.14 SV1.5
N$22
  Top 0.406: IC2.1 48.9,14.47 C17.1
N$23
  Top 0.406: IC2.3 46.35,14.73 C17.2
N$24
  Top 0.305: U5.12 27.3,8.26 28.57,9.53 SV1.2
N$25
  Top 0.406: IC2.4 45.09,13.34 43.81,14.61 43.81,15.11 C18.1
N$26
  Top 0.406: IC2.5 43.81,12.7 43.18,13.34 42.55,13.34 41.27,14.61 41.27,15.11 C18.2
N$27
  Top 0.406: IC2.2 47.62,9.53 48.26,8.89 50.16,8.89 50.16,9.02 C19.2
N$28
  Top 0.406: IC2.6 42.55,8.89 41.91,8.26 38.73,8.26 37.47,6.99 C20.1
N$29
  Top 0.406: IC2.7 41.27,12.7 40.64,13.34 38.73,13.34 SV2.2
N$30
  Top 0.406: SV2.3 39.37,9.53 40.01,10.16 IC2.8
N$31
  Top 0.61: LED1.A 37.47,24.13 R32.1
N$32
  Top 0.406: Q3.1 69.6,71.37 69.85,71.12 69.85,55.88 68.58,54.61 67.48,54.61 Q4.C 64.46,54.44 R31.2
N$33
  Top 0.406: Q4.B 64.46,52.24 R30.1
N$34
  Top 0.406: LED2.A R33.1
PWM
  Top 0.305: U5.6 13.97,10.79 13.49,11.28 R26.2 R33.2
RX
  Top 0.305: U5.8 19.68,5.71 20.95,4.45 34.92,4.45 35.56,5.08 39.9,5.08 IC2.9
SSNS
  Top 0.305: U5.2 10.79,20.95 R20.1 10.64,21.59 R21.2
TEMP
  Top 0.305: U6.4 13.82,6.35 R3.1 14.76,6.5 16.51,8.26 U5.7
TG
  Top 0.406: U1.15 21.31,44.17 21.59,44.45 26.69,44.45 Q1.1
TX  (via drill 0.41)
  Top 0.305: v41.27,6.99 IC2.10
  Bottom 0.305: U5.11 41.27,5.71 v41.27,6.99
VBAT  (via drill 0.41)
  Top 0.406: U3.8 37.81,64.48 38.1,64.77 38.1,66.52 R14.2 38.63,66.3 | R22.2 33.66,21.59 v35.56,23.5
  Top 1.778: R12.P$2 41.02,64.39 38.73,66.67 R14.2 38.1,66.67 38.1,69.97 X2.1
  Bottom 0.305: v35.56,23.5 50.16,23.5 62.23,35.56 62.23,61.59 54.61,69.22 54.61,72.39 53.34,73.66 37.47,73.66 36.83,73.03 36.95,72.91 X2.1
VCC  (via drill 0.41)
  Top 0.406: C19.1 49.4,6.86 48.9,6.35 IC2.16
  Top 0.61: 41.93,18.92 C15.1 | 41.93,18.92 R32.2 36.35,17.78 v34.92,17.78 | C19.1 51.94,6.86 52.7,7.62 52.7,12.7 | IC2.16 48.9,2.54 48.26,1.91 14.61,1.91 13.97,2.54 R3.2 13.97,3.81 12.7,5.08 U6.3 v8.26,5.08 | R16.1 29.84,60.33 29.84,58.42 29.21,57.78 26.04,57.78 24.77,59.05 v24.77,66.04 | v1.91,7.62 v1.91,30.48 | 52.7,12.7 52.07,12.7 51.44,13.34 51.44,17.14 49.53,19.05 42.06,19.05 41.93,18.92 | 52.7,12.7 IC1.3
  Bottom 0.61: v24.77,66.04 10.16,66.04 1.91,57.78 v1.91,30.48 | v8.26,5.08 2.54,5.08 1.91,5.71 v1.91,7.62 | SV1.6 31.75,19.68 33.66,17.78 v34.92,17.78
VFB  (via drill 0.41)
  Top 0.406: U1.6 11.09,41.57 10.16,40.64 10.16,37.62 R4.1 9.53,37.47 8.89,36.83 R5.2 6.99,35.08 v6.99,31.75 | R29.1 R28.1 6.99,16.66 6.99,23.5 8.26,24.77 v8.89,24.77
  Bottom 0.406: v8.89,24.77 8.89,27.94 6.99,29.84 v6.99,31.75
VIN
  Top 0.305: 8.41,44.45 R1.2
  Top 0.406: 10.48,49.21 10.16,48.9 | U2.4 20.07,62.65 R9.P$2 | 11.43,44.82 8.62,44.82 8.26,44.45 8.41,44.45 | 11.43,44.82 U1.1 | 11.43,48.26 11.43,44.82
  Top 1.27: 10.16,49.53 10.48,49.21 | C13.+ 10.16,51.24 | C13.+ 9.72,51.63 | R9.P$2 20.07,58.8 19.68,58.42 | 6.48,51.44 C13.+ | 6.48,51.44 C12.1 | 6.48,51.44 6.35,51.44 C10.1 C11.1
  Top 1.93: Q1.3 34.25,46.4 32.38,48.26 11.43,48.26 10.48,49.21 | 10.16,51.24 10.16,49.53 | 9.72,51.63 19.68,58.42
  pour Top (isolate 0.61, no thermals): 29.21,47.62 29.21,41.27 30.48,41.27 33.02,38.73 44.45,38.73 44.45,47.62
VLOAD
  Top 0.406: R31.1 59.69,54.61 58.42,55.88 58.42,67.94 | U4.4 51.22,64.35 50.8,64.77 50.8,65.41 50.16,66.04 48.26,66.04
  Top 1.27: Q3.2 61.59,70.48 59.05,67.94 58.42,67.94 50.16,67.94 48.26,66.04 46.74,64.52 R17.P$2
VOUT  (via drill 0.41)
  Top 0.305: U1.8 | v39.37,37.47 46.35,37.47 v46.35,43.81
  Top 0.406: R19.1 53.19,65.41 53.34,65.41 53.34,64.14 52.7,63.5 52.07,63.5 52.04,63.47 U4.5 50.64,62.45 R17.P$1 | 44.07,57.78 36.2,57.78 35.56,58.42 35.56,59.54 R13.2 35.41,61.44 35.56,61.59 36.83,61.59 37.19,61.95 U3.5 | U1.8 12.7,40.27 12.7,37.62 R4.2 v14.61,37.47
  Top 0.813: v45.09,29.21 45.09,22.23 46.35,20.95 52.7,20.95 53.98,19.68 53.98,17.86 IC1.1 | v48.9,47.62 48.9,51.44
  Top 1.27: 27.94,52.07 27.82,51.95 C9.+
  Top 1.778: 27.94,55.24 27.94,52.07 | 27.94,55.24 C8.1 | 43.81,56.01 31.75,56.01 31.75,55.88 31.11,55.24 27.94,55.24 | R17.P$1 49.78,56.9 50.48,56.2 | R12.P$1 44.07,57.78 44.07,56.26 43.81,56.01 | 50.48,56.2 51.31,54.74 R8.P$1 48.9,51.44 C2.+ | 43.81,56.01 50.29,56.01 50.48,56.2 | 43.81,56.01 42.67,56.01
  Bottom 0.305: v14.61,37.47 v39.37,37.47 | v46.35,43.81 46.35,47.62 v48.9,47.62
  Bottom 0.813: v45.09,29.21 46.35,29.21 48.9,31.75 v48.9,47.62
VSUN  (via drill 0.41)
  Top 0.305: v15.88,58.42 17.78,59.69 17.78,60.81 R11.1 | R20.2 10.79,25.4 10.16,26.04 v6.99,26.04
  Top 0.406: U2.5 18.2,64.55 | R11.1 17.3,61.59 17.14,61.59 17.14,62.87 17.78,63.5 18.41,63.5 18.41,64.52 U2.5 | U2.5 18.83,64.55 20.32,66.04 23.11,66.04
  Top 1.016: D5.K 13.72,68.58 20.32,68.58 20.95,67.94 22.73,67.94 23.11,67.56
  Top 1.778: R9.P$1 23.11,66.04 23.11,67.56 23.5,67.94 23.5,67.98 X1.3
  Bottom 0.305: v6.99,26.04 4.45,27.94 4.45,55.88 6.99,58.42 v15.88,58.42

### Text on the board
Top: TIER Solar Controller | MRamos
Bottom: Oct2009